# Altium project bch-onemic_v0.1.PrjPcb
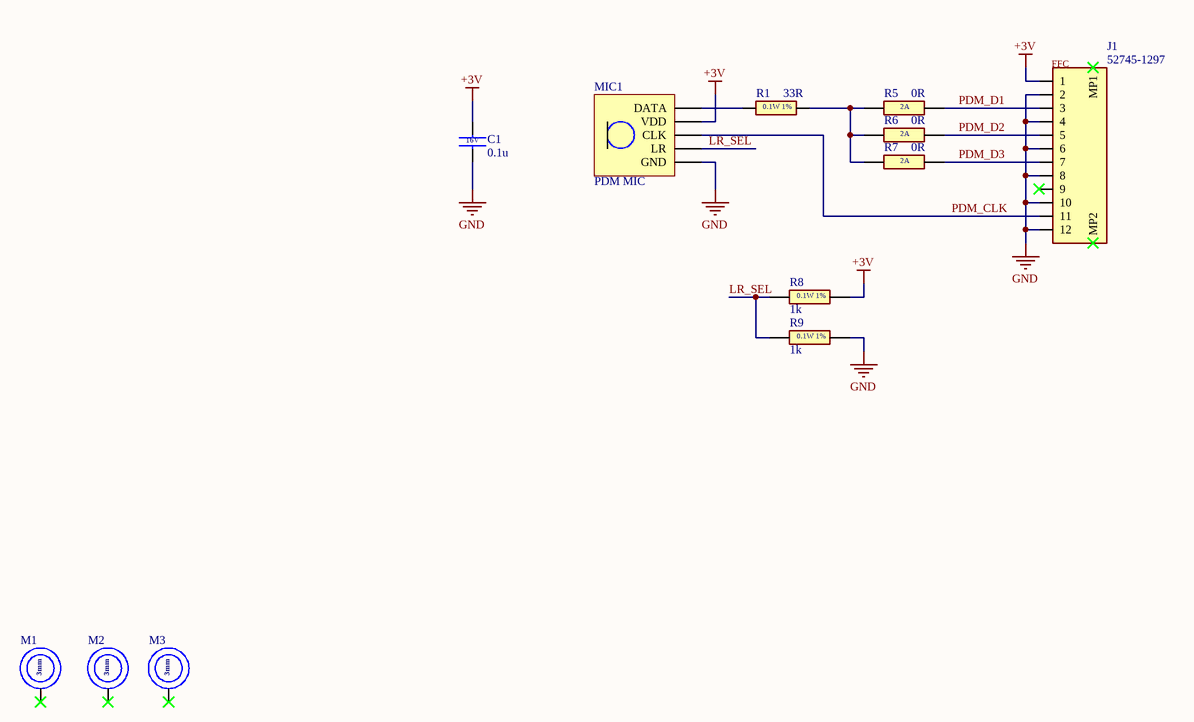
[diagram p0: top.SchDoc]
Author: Martin Maxa; Date: 2025-07-13; Name: onemic; Project: boomchecker; Revision: 0.1
1 sheet, 12 parts. Net scope: hierarchical (ports join the sheet entries above them; power ports are global).
Board files: bch-onemic_v0.1.PcbDoc, bch-onemic_v0.1_panel.PcbDoc

## Sheet top.SchDoc
size A4; SheetNumber: 1; SheetTotal: 1

### Parts
C1  0.1u  [CAPC1608X95N]
J1  52745-1297  [527451297]
M1  MTH-3MM  [MountingHole_3.0mm_NPTH]  (value not drawn)
M2  MTH-3MM  [MountingHole_3.0mm_NPTH]  (value not drawn)
M3  MTH-3MM  [MountingHole_3.0mm_NPTH]  (value not drawn)
MIC1  PDM MIC  [LLGA-5-4X3]
R1  33R  [RESC1608X55N]
R5  0R  [RESC1608X50N]
R6  0R  [RESC1608X50N]
R7  0R  [RESC1608X50N]
R8  1k  [RESC1608X50N]
R9  1k  [RESC1608X50N]

### Nets
+3V: C1.1 J1.1 MIC1.2(VDD) R8.2
GND: C1.2 J1.2 J1.4 J1.6 J1.8 J1.10 J1.12 MIC1.5(GND) R9.2
LR_SEL: MIC1.4(LR) R8.1 R9.1  [project net LR_SEL_1]
PDM_CLK: J1.11 MIC1.3(CLK)  [project net PDM_CLK_1]
PDM_D1: J1.3 R5.2  [project net PDM_D1_1]
PDM_D2: J1.5 R6.2  [project net PDM_D2_1]
PDM_D3: J1.7 R7.2  [project net PDM_D3_1]
NetMIC1_1: MIC1.1(DATA) R1.1
NetR1_2: R1.2 R5.1 R6.1 R7.1

Not connected (* = marked no-connect by the designer): J1 9* MP1* MP2*; M1 1*; M2 1*; M3 1*

### Notes on the sheet
- (near J1) FFC
- Název výkresu /drawing title/:
- Název souboru /sheet name/:
- Varianta /variant/:
- Organizace /organisation/:
- ČVUT FEL
- Kreslil /drawn by/:
- Datum /date/:
- Podpis /signature/:
- List /sheet/:
- Verze /version/:
- /
- (in symbol ECK+100n16V) 16V
- (in symbol EMECH-MTH-3MM) 3mm
- (in symbol ER+1K) 0.1W 1%
- (in symbol ER+33R) 0.1W 1%

### Library data of the parts
C1 = ECK+100n16V: 16V 0.1uF XR7 0603 10%; Manufacturer_Name: KEMET; Manufacturer_Part_Number: C0603C104K4RAC-TU; Datasheet Link: https://connect.kemet.com:7667/gateway/IntelliData-ComponentDocumentation/1.0/download/specsheet/C0603C104K4RACTU; Height: 0.95mm; Mouser Part Number: 80-C0603C104K4RAC; Arrow Part Number: C0603C104K4RAC-TU; Arrow Price/Stock: https://www.arrow.com/en/products/c0603c104k4ractu/kemet-corporation
J1 = EJ+52745-1297: FFC & FPC Connectors RA SMT ZIF TOP 12P GOLD, Pitch: 0.5 mm, Mounting Angle / Contact Location: Right Angle / Top Contact, Current Rating: 500 mA, Voltage Rating: 50 V; Manufacturer_Name: Molex; Datasheet Link: https://www.molex.com/pdm_docs/sd/527451297_sd.pdf; Height: 2mm; Manufacturer_Part_Number: 52745-1297; Mouser Part Number: 538-52745-1297; Mouser Price/Stock: https://www.mouser.co.uk/ProductDetail/Molex/52745-1297?qs=nDwhpid8gJaCgIkitRUygg%3D%3D
M1-M3 = EMECH-MTH-3MM
MIC1 = EX+IM67D130AXTSA2: MEMS Microphones MIC DBP DIGITAL
R1 = ER+33R: Resistor 1% 0.1W; Manufacturer_Name: ROYALOHM; Manufacturer_Part_Number: 0603WAF330JT5E; Datasheet Link: https://datasheet.lcsc.com/lcsc/2206010116_UNI-ROYAL-Uniroyal-Elec-0603WAF330JT5E_C23140.pdf; Height: 0.55mm; Mouser Part Number: 303-0603WAF330JT5E; Mouser Price/Stock: https://www.mouser.co.uk/ProductDetail/Royalohm/0603WAF330JT5E?qs=e8oIoAS2J1RitKiKgULsBA%3D%3D
R5-R7 = ER+0R: 2A; Manufacturer_Name: Vishay; Manufacturer_Part_Number: RCA06030000ZSEA; Datasheet Link: https://componentsearchengine.com/Datasheets/2/RCA06030000ZSEA.pdf; Height: 0.5mm; Mouser Part Number: 71-RCA06030000ZSEA; Mouser Price/Stock: https://www.mouser.co.uk/ProductDetail/Vishay-Draloric/RCA06030000ZSEA?qs=4%252Ber4tcBTOg9nmK7yWNpHw%3D%3D; Arrow Part Number: RCA06030000ZSEA; Arrow Price/Stock: https://www.arrow.com/en/products/rca06030000zsea/vishay?region=nac
R8 R9 = ER+1K: Resistor 1%, 0.1W; Manufacturer_Name: Vishay; Manufacturer_Part_Number: CRCW06031K00FKEA; Datasheet Link: http://www.vishay.com/docs/20035/dcrcwe3.pdf; Height: 0.5mm; Mouser Part Number: 71-CRCW0603-1.0K-E3; Mouser Price/Stock: https://www.mouser.co.uk/ProductDetail/Vishay-Dale/CRCW06031K00FKEA?qs=CToX950LohJasujQx7GY3g%3D%3D; Arrow Part Number: CRCW06031K00FKEA; Arrow Price/Stock: https://www.arrow.com/en/products/crcw06031k00fkea/vishay?region=europe

## Assembly variants
onemic: not fitted R6 R7 R8